# Altium schematic sheet 调制板原理图.SchDoc
size A1; Organization: Protel International P/L; Address1: L3, 12a Rodborough Rd; Address2: Frenchs Forest; Address3: NSW; Address4: Australia 2086
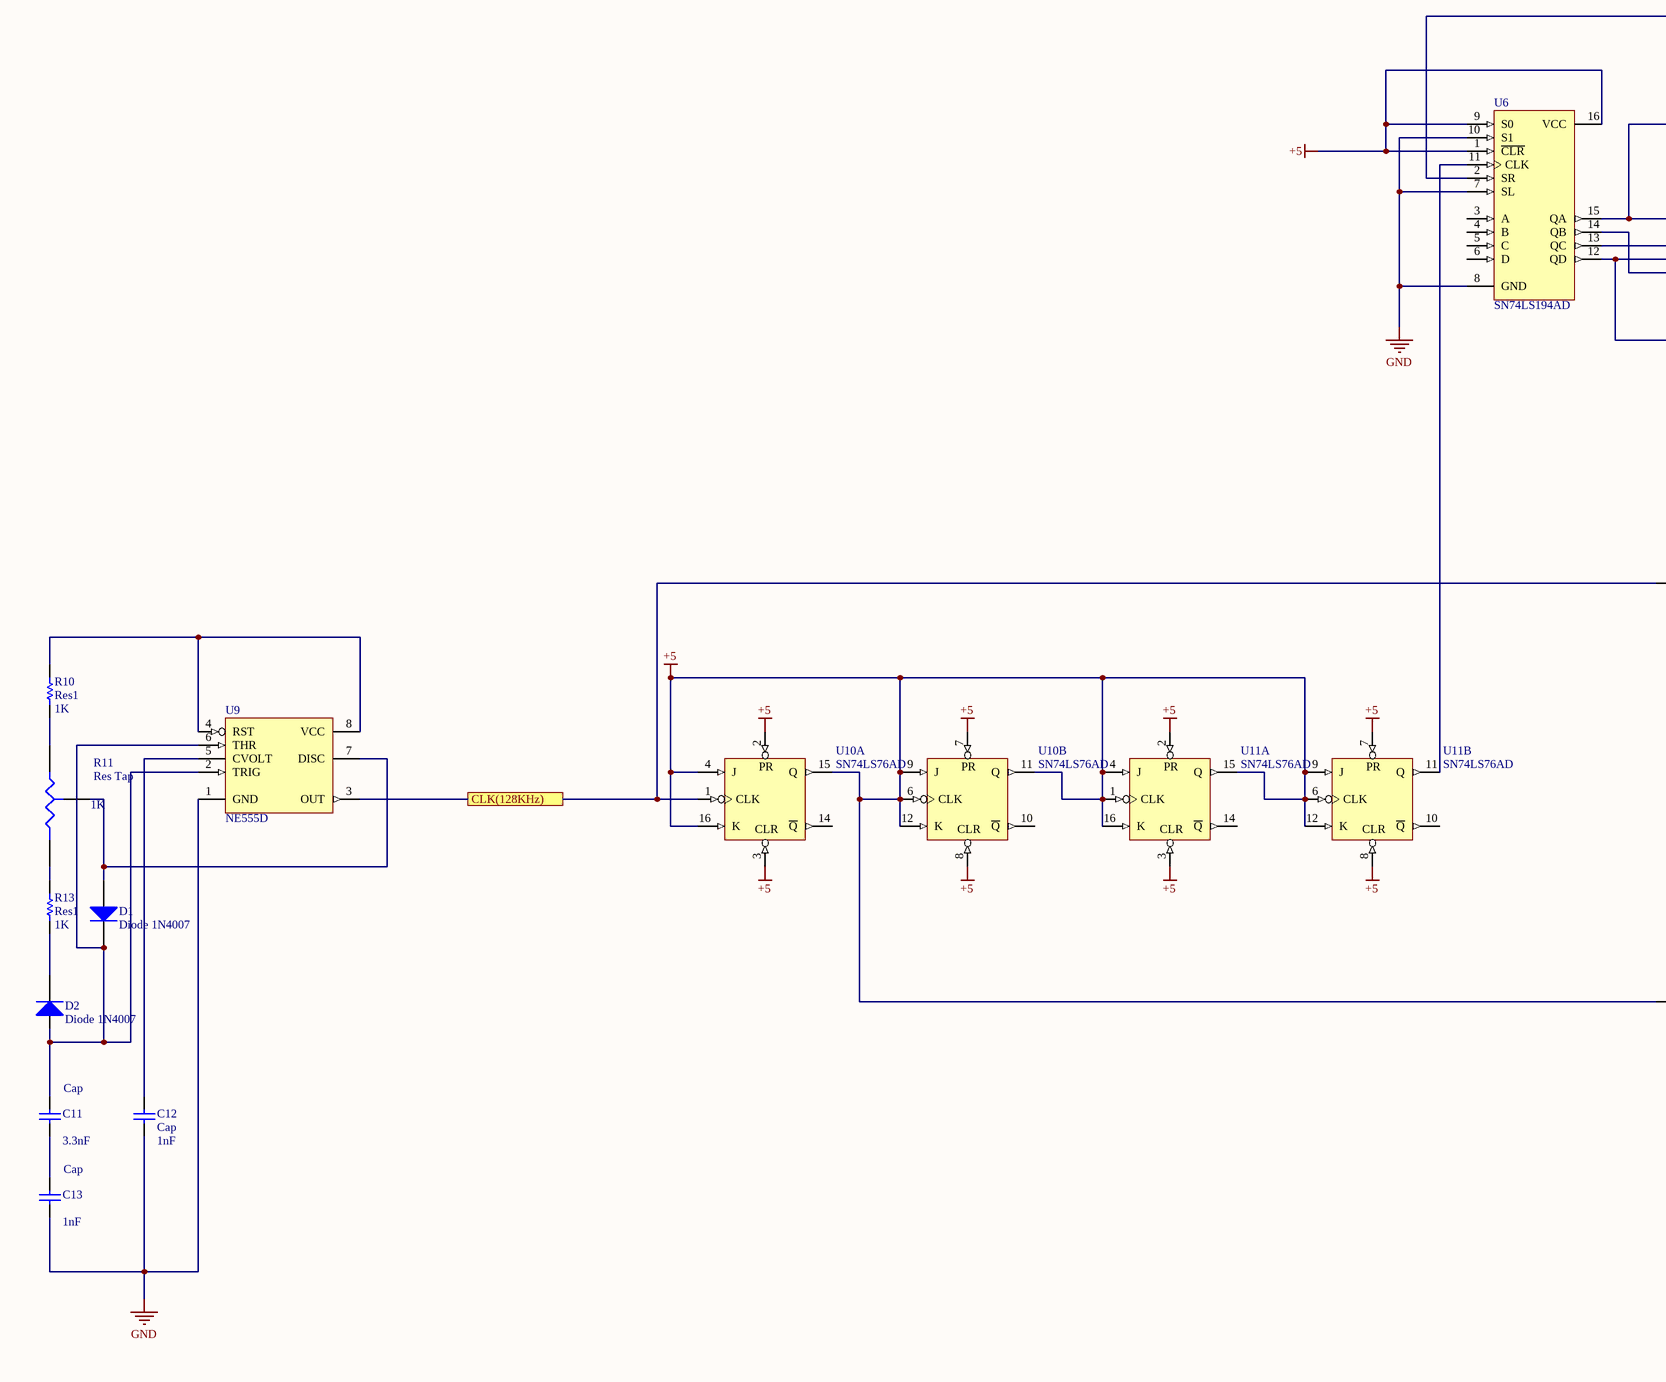
[diagram p0: 调制板原理图.SchDoc, left]
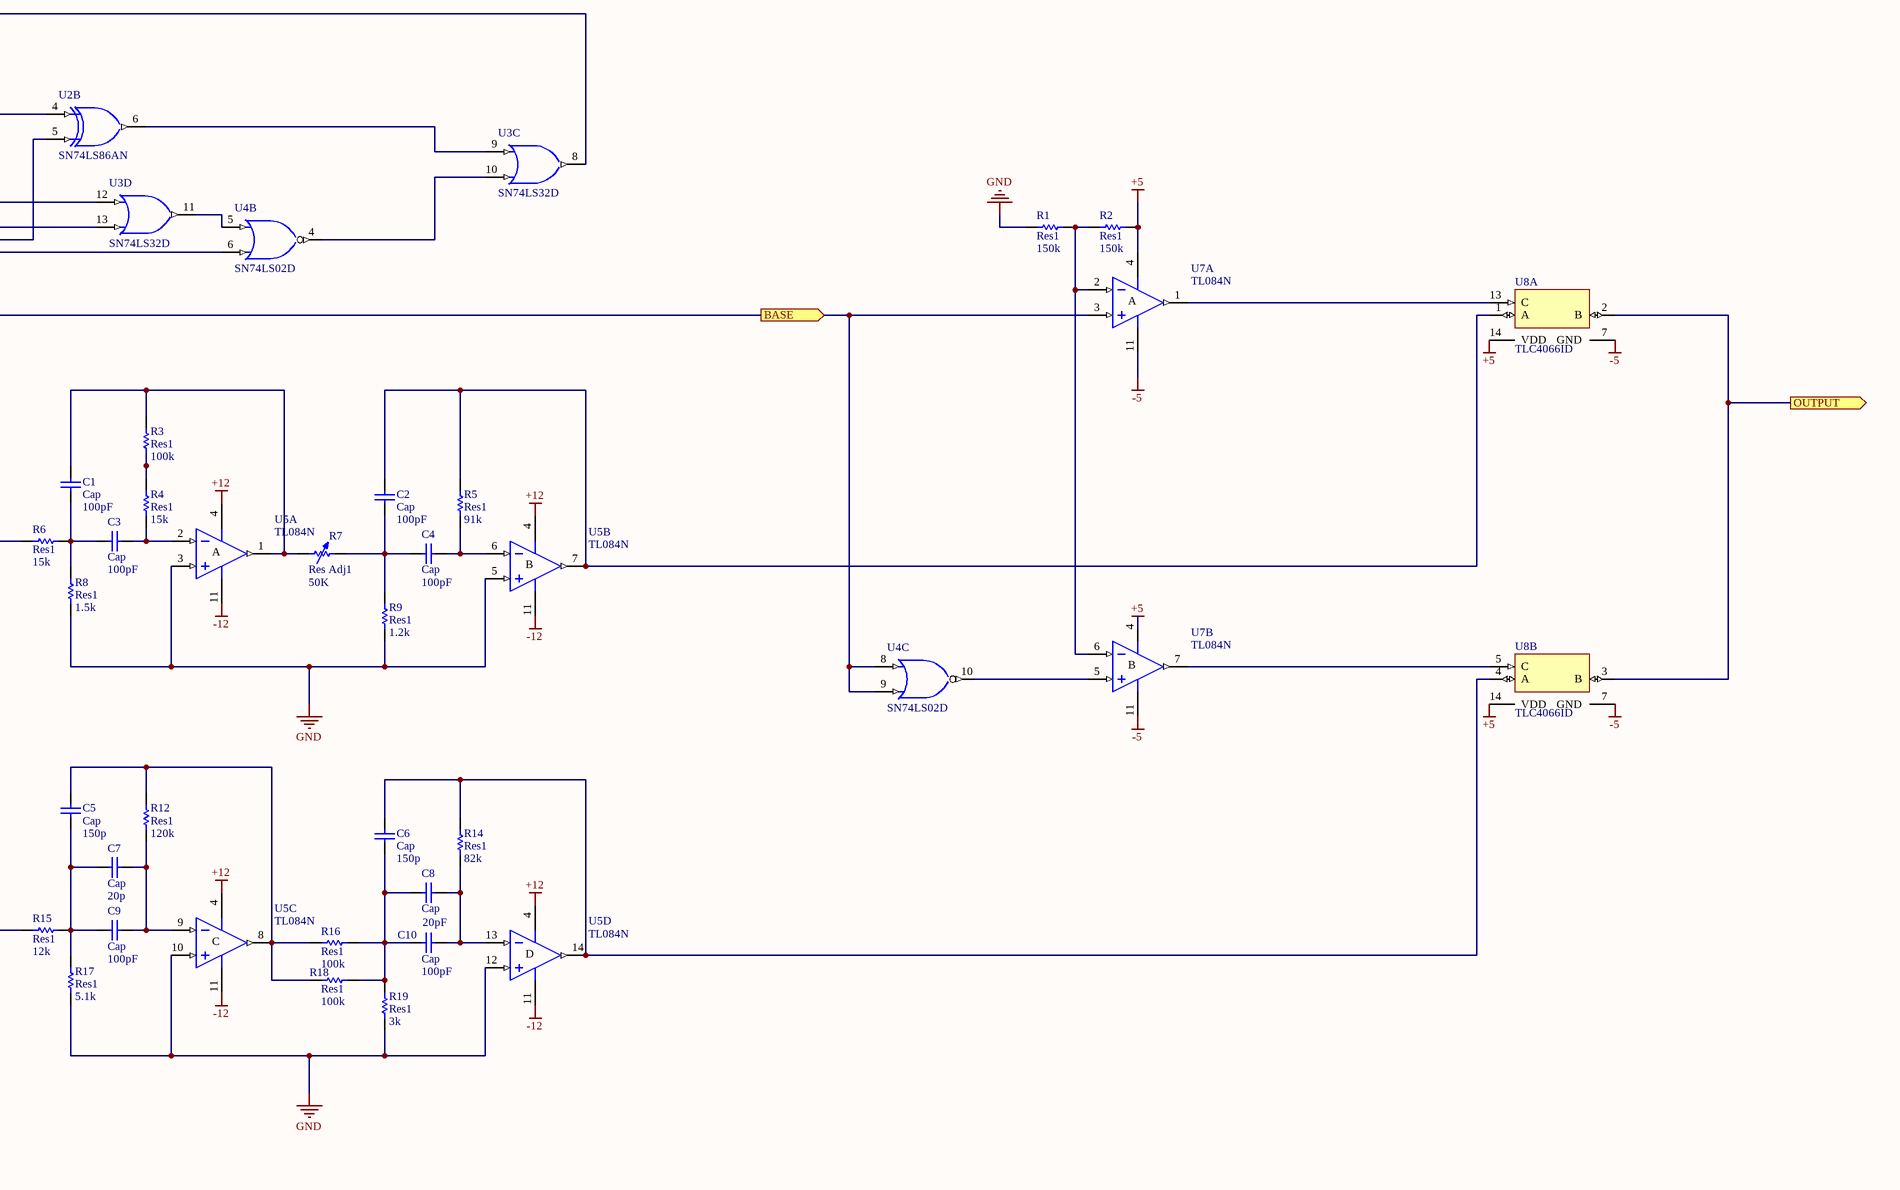
[diagram p1: 调制板原理图.SchDoc, right]

## Parts
C1  Cap  value 100pF  [RAD-0.3]
C2  Cap  value 100pF  [RAD-0.3]
C3  Cap  value 100pF  [RAD-0.3]
C4  Cap  value 100pF  [RAD-0.3]
C5  Cap  value 150p  [RAD-0.3]
C6  Cap  value 150p  [RAD-0.3]
C7  Cap  value 20p  [RAD-0.3]
C8  Cap  value 20pF  [RAD-0.3]
C9  Cap  value 100pF  [RAD-0.3]
C10  Cap  value 100pF  [RAD-0.3]
C11  Cap  value 3.3nF  [RAD-0.3]
C12  Cap  value 1nF  [RAD-0.3]
C13  Cap  value 1nF  [RAD-0.3]
D1  Diode 1N4007  [DO-41]
D2  Diode 1N4007  [DO-41]
R1  Res1  value 150k  [AXIAL-0.3]
R2  Res1  value 150k  [AXIAL-0.3]
R3  Res1  value 100k  [AXIAL-0.3]
R4  Res1  value 15k  [AXIAL-0.3]
R5  Res1  value 91k  [AXIAL-0.3]
R6  Res1  value 15k  [AXIAL-0.3]
R7  Res Adj1  value 50K  [AXIAL-0.7]
R8  Res1  value 1.5k  [AXIAL-0.3]
R9  Res1  value 1.2k  [AXIAL-0.3]
R10  Res1  value 1K  [AXIAL-0.3]
R11  Res Tap  value 1K  [VR3]
R12  Res1  value 120k  [AXIAL-0.3]
R13  Res1  value 1K  [AXIAL-0.3]
R14  Res1  value 82k  [AXIAL-0.3]
R15  Res1  value 12k  [AXIAL-0.3]
R16  Res1  value 100k  [AXIAL-0.3]
R17  Res1  value 5.1k  [AXIAL-0.3]
R18  Res1  value 100k  [AXIAL-0.3]
R19  Res1  value 3k  [AXIAL-0.3]
U2  SN74LS86AN  [N014]  (part B of 4)
U3  SN74LS32D  [D014_L]  (parts C,D of 4)
U4  SN74LS02D  [D014_L]  (parts B,C of 4)
U5  TL084N  [N014]  (parts A,B,C,D of 4)
U6  SN74LS194AD  [D016_L]
U7  TL084N  [N014]  (parts A,B of 4)
U8  TLC4066ID  [D014_L]  (parts A,B of 4)
U9  NE555D  [D008_L]
U10  SN74LS76AD  [D016_L]  (parts A,B of 2)
U11  SN74LS76AD  [D016_L]  (parts A,B of 2)

## Ports
BASE (out), CLK(128KHz), OUTPUT (out)

## Nets
+5: R2.2 R15.1 U6.1(~{CLR}) U6.9(S0) U6.16(VCC) U7.4(V+) U8.14(VDD) U10.2(PR) U10.3(CLR) U10.4(J) U10.6(CLK) U10.7(PR) U10.8(CLR) U10.9(J) U10.11(Q) U10.12(K) U10.15(Q) U10.16(K) U11.1(CLK) U11.2(PR) U11.3(CLR) U11.4(J) U11.6(CLK) U11.7(PR) U11.8(CLR) U11.9(J) U11.12(K) U11.15(Q) U11.16(K)  [also labelled VDD]
+12: U5.4(V+)
-5: C12.1 C13.1 R1.1 R8.1 R9.1 R17.1 R19.1 U2.7(GND) U3.7(GND) U4.7(GND) U5.3(IN+) U5.5(IN+) U5.10(IN+) U5.12(IN+) U6.7(SL) U6.8(GND) U6.10(S1) U7.11(V-) U8.7(GND) U9.1(GND) U10.13(GND) U11.13(GND)  [also labelled GND]
-12: U5.11(V-)
VCC: U2.14(VCC) U3.14(VCC) U4.14(VCC) U10.5(VCC) U11.5(VCC)
BASE: U2.5(B) U4.8(A) U4.9(B) U6.12(QD) U7.3(IN+) ; port BASE
CLK(128KHz): R6.1 U9.3(OUT) U10.1(CLK) ; port CLK(128KHz)
OUTPUT: U8.2(B) U8.3(B) ; port OUTPUT
NetC1_1: C1.1 C3.1 R6.2 R8.2
NetC1_2: C1.2 R3.2 R7.1 U5.1(OUT)
NetC2_1: C2.1 C4.1 R7.2 R9.2
NetC2_2: C2.2 R5.2 U5.7(OUT) U8.1(A)
NetC3_2: C3.2 R4.1 U5.2(IN-)
NetC4_2: C4.2 R5.1 U5.6(IN-)
NetC5_1: C5.1 C7.1 C9.1 R15.2 R17.2
NetC5_2: C5.2 R12.2 R16.1 R18.1 U5.8(OUT)
NetC6_1: C6.1 C8.1 C10.1 R16.2 R18.2 R19.2
NetC6_2: C6.2 R14.2 U5.14(OUT) U8.4(A)
NetC7_2: C7.2 C9.2 R12.1 U5.9(IN-)
NetC8_2: C8.2 C10.2 R14.1 U5.13(IN-)
NetC11_1: C11.1 C13.2
NetC11_2: C11.2 D1.2(K) D2.1(A) U9.2(TRIG) U9.6(THR)
NetC12_2: C12.2 U9.5(CVOLT)
NetD1_1: D1.1(A) R11.3(TAP) U9.7(DISC)
NetD2_2: D2.2(K) R13.1
NetR1_2: R1.2 R2.1 U7.2(IN-) U7.6(IN-)
NetR3_1: R3.1 R4.2
NetR10_1: R10.1 R11.1(A)
NetR10_2: R10.2 U9.4(RST) U9.8(VCC)
NetR11_2: R11.2(B) R13.2
NetU2_4: U2.4(A) U3.12(A) U6.15(QA)
NetU2_6: U2.6(Y) U3.9(A)
NetU3_8: U3.8(Y) U6.2(SR)
NetU3_10: U3.10(B) U4.4(Y)
NetU3_11: U3.11(Y) U4.5(A)
NetU3_13: U3.13(B) U6.13(QC)
NetU4_6: U4.6(B) U6.14(QB)
NetU4_10: U4.10(Y) U7.5(IN+)
NetU6_11: U6.11(CLK) U11.11(Q)
NetU7_1: U7.1(OUT) U8.13(C)
NetU7_7: U7.7(OUT) U8.5(C)

Not connected (* = marked no-connect by the designer): U6 3(A) 4(B) 5(C) 6(D); U10 10(~{Q}) 14(~{Q}); U11 10(~{Q}) 14(~{Q})

## Notes on the sheet
- Title
- Size:
- Date:
- File:
- A1
- Number:
- Time:
- Revision:
- Sheet
- of
- (in symbol TL084N, part A) A
- (in symbol TL084N, part B) B
- (in symbol TL084N, part C) C
- (in symbol TL084N, part D) D

## Library data of the parts
C1-C13 = Cap: Capacitor; Published: 8-Jun-2000; LatestRevisionDate: 17-Jul-2002; LatestRevisionNote: Re-released for DXP Platform.; PackageReference: RAD-0.3; Publisher: Altium Limited; PackageDescription: Radial Cap, Thru-Hole; 2 Leads; 0.3 in Pin Spacing
D1 D2 = Diode 1N4007: 1 Amp General Purpose Rectifier; Published: 8-Jun-2000; LatestRevisionDate: 17-Jul-2002; LatestRevisionNote: Re-released for DXP Platform.; DatasheetVersion: 1998; PackageVersion: Aug-1999; PackageReference: DO-41; Publisher: Altium Limited; PackageDescription: Diode, Axial; Body 5.2 x 2.7 mm (LxDia. max), Lead Dia. 0.86 mm (max); Code_JEDEC: DO-204-AL; ComponentLink1Description: Manufacturer Link; ComponentLink1URL: http://www.fairchildsemi.com/; ComponentLink2Description: Datasheet; ComponentLink2URL: http://www.fairchildsemi.com/ds/1N%2F1N4001.pdf
R1-R6 R8-R10 R12-R19 = Res1: Resistor; Published: 8-Jun-2000; LatestRevisionDate: 17-Jul-2002; LatestRevisionNote: Re-released for DXP Platform.; PackageReference: AXIAL-0.3; Publisher: Altium Limited; PackageDescription: Axial Device, Thru-Hole; 2 Leads; 0.3 in Pin Spacing
R7 = Res Adj1: Variable Resistor; Set Position: 0.5; Published: 8-Jun-2000; LatestRevisionDate: 17-Jul-2002; LatestRevisionNote: Re-released for DXP Platform.; PackageReference: AXIAL-0.7; Publisher: Altium Limited; PackageDescription: Axial Device, Thru-Hole; 2 Leads; 0.7 in Pin Spacing
R11 = Res Tap: Tapped Resistor; Sim Note: Enter the Resistance value and the set point into parameter fields.; Set Position: 0.5; Published: 24-Mar-1999; LatestRevisionDate: 17-Jul-2002; LatestRevisionNote: Re-released for DXP Platform.; PackageReference: VR3; Publisher: Altium Limited; PackageDescription: Variable Resistor, Thru-Hole; 3 Leads
U2 = SN74LS86AN: Quadruple 2-Input Exclusive-OR Gate; Published: 8-Jun-2000; LatestRevisionDate: 04-Mar-2005; LatestRevisionNote: Stylized 3D Model Added.; DatasheetVersion: Mar-1988; PackageVersion: Oct-1995; PackageReference: N014; Publisher: Altium Limited; PackageDescription: DIP; 14 Leads; Row Spacing 7.62 mm; Pitch 2.54 mm; ComponentLink1Description: Manufacturer Link; ComponentLink1URL: http://www.ti.com/; ComponentLink2Description: Datasheet; ComponentLink2URL: http://www-s.ti.com/sc/ds/sn74ls86a.pdf
U3 = SN74LS32D: Quadruple 2-Input Positive-OR Gate; Published: 8-Jun-2000; LatestRevisionDate: 13-Apr-2006; LatestRevisionNote: IPC-7351 Footprint Added.; DatasheetVersion: Mar-1988; PackageVersion: Jan-1998; PackageReference: D014; Publisher: Altium Limited; PackageDescription: 14-Pin Small Outline Integrated Circuit 1.27 mm Pitch; Code_IPC: SOIC127P600-14; ComponentLink1Description: Manufacturer Link; ComponentLink1URL: http://www.ti.com/; ComponentLink2Description: Datasheet; ComponentLink2URL: http://www-s.ti.com/sc/ds/sn74ls32.pdf
U4 = SN74LS02D: Quadruple 2-Input Positive-NOR Gate; Published: 8-Jun-2000; LatestRevisionDate: 13-Apr-2006; LatestRevisionNote: IPC-7351 Footprint Added.; DatasheetVersion: Mar-1988; PackageVersion: Jan-1998; PackageReference: D014; Publisher: Altium Limited; PackageDescription: 14-Pin Small Outline Integrated Circuit 1.27 mm Pitch; Code_IPC: SOIC127P600-14; ComponentLink1Description: Manufacturer Link; ComponentLink1URL: http://www.ti.com/; ComponentLink2Description: Datasheet; ComponentLink2URL: http://www-s.ti.com/sc/ds/sn54s02.pdf
U5 U7 = TL084N: JFET-Input Operational Amplifier; Published: 16-Jan-2001; LatestRevisionDate: 04-Mar-2005; LatestRevisionNote: Stylized 3D Model Added.; DatasheetVersion: Feb-1999; PackageVersion: Oct-1995; PackageReference: N014; Publisher: Altium Limited; PackageDescription: DIP; 14 Leads; Row Spacing 7.62 mm; Pitch 2.54 mm; ComponentLink1Description: Manufacturer Link; ComponentLink1URL: http://www.ti.com/; ComponentLink2Description: Datasheet; ComponentLink2URL: http://www-s.ti.com/sc/ds/tl084.pdf
U6 = SN74LS194AD: 4-Bit Bidirectional Universal Shift Register; Published: 8-Jun-2000; LatestRevisionDate: 13-Apr-2006; LatestRevisionNote: IPC-7351 Footprint Added.; DatasheetVersion: Mar-1988; PackageVersion: Jan-1998; PackageReference: D016; Publisher: Altium Limited; PackageDescription: 16-Pin Small Outline Integrated Circuit 1.27 mm Pitch; Code_IPC: SOIC127P600-16; ComponentLink1Description: Manufacturer Link; ComponentLink1URL: http://www.ti.com/; ComponentLink2Description: Datasheet; ComponentLink2URL: http://www-s.ti.com/sc/ds/sn74ls194a.pdf
U8 = TLC4066ID: Quadruple Bilateral Analog Switch; Published: 8-Jun-2000; LatestRevisionDate: 13-Apr-2006; LatestRevisionNote: IPC-7351 Footprint Added.; DatasheetVersion: Jan-1986; PackageVersion: Jan-1998; PackageReference: D014; Publisher: Altium Limited; PackageDescription: 14-Pin Small Outline Integrated Circuit 1.27 mm Pitch; Code_IPC: SOIC127P600-14; ComponentLink1Description: Manufacturer Link; ComponentLink1URL: http://www.ti.com/
U9 = NE555D: Precision Timer; Published: 16-Jan-2001; LatestRevisionDate: 13-Apr-2006; LatestRevisionNote: IPC-7351 Footprint Added.; DatasheetVersion: Feb-1992; PackageVersion: Jan-1998; PackageReference: D008; Publisher: Altium Limited; PackageDescription: 8-Pin Small Outline Integrated Circuit 1.27 mm Pitch; Code_IPC: SOIC127P600-8; ComponentLink1Description: Manufacturer Link; ComponentLink1URL: http://www.ti.com/; ComponentLink2Description: Datasheet; ComponentLink2URL: http://www-s.ti.com/sc/ds/ne555.pdf
U10 U11 = SN74LS76AD: Dual J-K Flip-Flop with Preset and Clear; ComponentAvailability: Obsolete; Published: 8-Jun-2000; LatestRevisionDate: 13-Apr-2006; LatestRevisionNote: IPC-7351 Footprint Added.; DatasheetVersion: Mar-1988; PackageVersion: Jan-1998; PackageReference: D016; Publisher: Altium Limited; PackageDescription: 16-Pin Small Outline Integrated Circuit 1.27 mm Pitch; Code_IPC: SOIC127P600-16; ComponentLink1Description: Manufacturer Link; ComponentLink1URL: http://www.ti.com/; ComponentLink2Description: Datasheet; ComponentLink2URL: http://www-s.ti.com/sc/ds/sn74ls76a.pdf